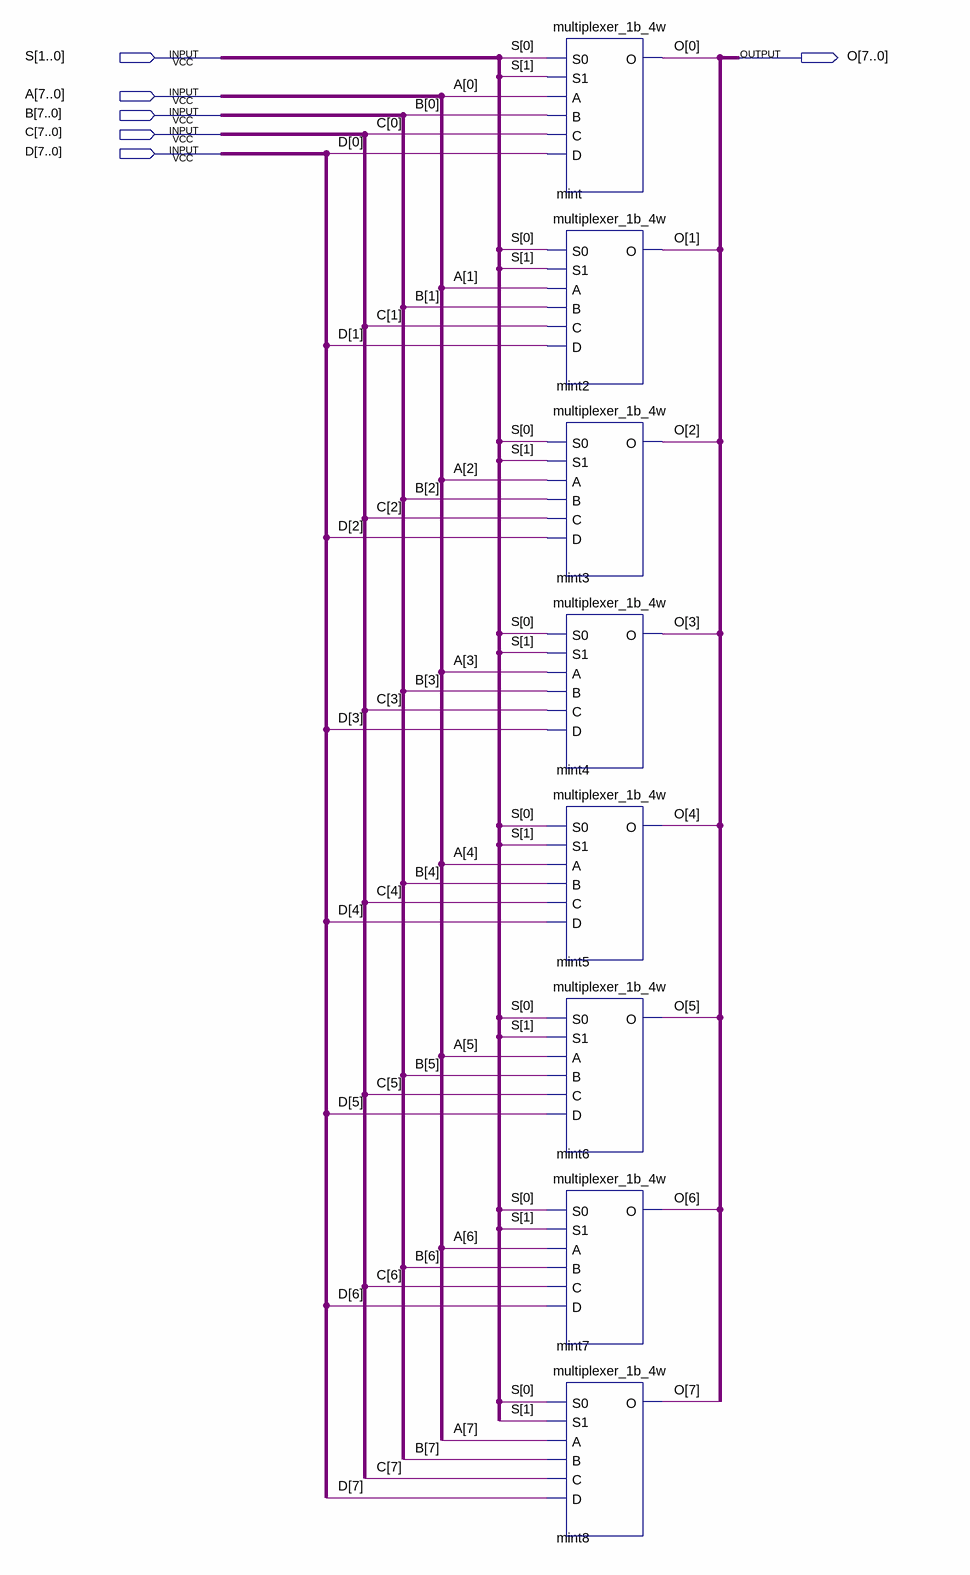
[diagram p0: schematic sheet]
// Quartus schematic multiplexer_8b_4w.bdf as structural Verilog: 8 symbols, 6 pins
module multiplexer_8b_4w (
  input  [1:0] S,
  input  [7:0] A,
  input  [7:0] B,
  input  [7:0] C,
  input  [7:0] D,
  output [7:0] O
);

  multiplexer_1b_4w mint (.S0(S[0]), .S1(S[1]), .A(A[0]), .B(B[0]), .C(C[0]), .D(D[0]), .O(O[0]));
  multiplexer_1b_4w mint2 (.S0(S[0]), .S1(S[1]), .A(A[1]), .B(B[1]), .C(C[1]), .D(D[1]), .O(O[1]));
  multiplexer_1b_4w mint3 (.S0(S[0]), .S1(S[1]), .A(A[2]), .B(B[2]), .C(C[2]), .D(D[2]), .O(O[2]));
  multiplexer_1b_4w mint4 (.S0(S[0]), .S1(S[1]), .A(A[3]), .B(B[3]), .C(C[3]), .D(D[3]), .O(O[3]));
  multiplexer_1b_4w mint5 (.S0(S[0]), .S1(S[1]), .A(A[4]), .B(B[4]), .C(C[4]), .D(D[4]), .O(O[4]));
  multiplexer_1b_4w mint6 (.S0(S[0]), .S1(S[1]), .A(A[5]), .B(B[5]), .C(C[5]), .D(D[5]), .O(O[5]));
  multiplexer_1b_4w mint7 (.S0(S[0]), .S1(S[1]), .A(A[6]), .B(B[6]), .C(C[6]), .D(D[6]), .O(O[6]));
  multiplexer_1b_4w mint8 (.S0(S[0]), .S1(S[1]), .A(A[7]), .B(B[7]), .C(C[7]), .D(D[7]), .O(O[7]));
endmodule
